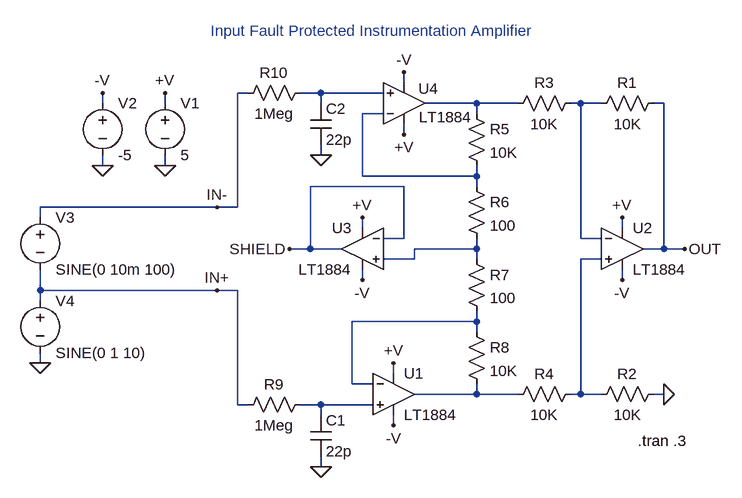
[diagram p0: schematic 1884.asc]
1884.asc, the LTspice schematic file:
Version 4
SHEET 1 896 680
WIRE 240 -240 240 -256
WIRE 0 -224 -16 -224
WIRE 112 -224 80 -224
WIRE 208 -224 112 -224
WIRE -224 -208 -224 -224
WIRE -128 -208 -128 -224
WIRE 112 -208 112 -224
WIRE 352 -208 272 -208
WIRE 416 -208 352 -208
WIRE 512 -208 496 -208
WIRE 544 -208 512 -208
WIRE 640 -208 624 -208
WIRE 208 -192 176 -192
WIRE 352 -192 352 -208
WIRE 240 -160 240 -176
WIRE 112 -128 112 -144
WIRE -224 -112 -224 -128
WIRE -128 -112 -128 -128
WIRE 176 -96 176 -192
WIRE 352 -96 352 -112
WIRE 352 -96 176 -96
WIRE 240 -80 96 -80
WIRE 352 -80 352 -96
WIRE -48 -48 -320 -48
WIRE -16 -48 -16 -224
WIRE -16 -48 -48 -48
WIRE -320 -32 -320 -48
WIRE 176 -16 176 -32
WIRE 576 -16 576 -32
WIRE 240 0 240 -80
WIRE 240 0 208 0
WIRE 512 0 512 -208
WIRE 544 0 512 0
WIRE 96 16 96 -80
WIRE 96 16 64 16
WIRE 144 16 96 16
WIRE 352 16 352 0
WIRE 352 16 256 16
WIRE 640 16 640 -208
WIRE 640 16 608 16
WIRE 672 16 640 16
WIRE 256 32 256 16
WIRE 256 32 208 32
WIRE 352 32 352 16
WIRE 544 32 512 32
WIRE 176 64 176 48
WIRE 576 64 576 48
WIRE -320 80 -320 48
WIRE -48 80 -320 80
WIRE -16 80 -48 80
WIRE -320 96 -320 80
WIRE 352 128 352 112
WIRE 352 128 160 128
WIRE 352 144 352 128
WIRE -320 192 -320 176
WIRE 224 208 224 192
WIRE 160 224 160 128
WIRE 192 224 160 224
WIRE 352 240 352 224
WIRE 352 240 256 240
WIRE 416 240 352 240
WIRE 512 240 512 32
WIRE 512 240 496 240
WIRE 544 240 512 240
WIRE 640 240 624 240
WIRE -16 256 -16 80
WIRE 0 256 -16 256
WIRE 112 256 80 256
WIRE 192 256 112 256
WIRE 112 272 112 256
WIRE 224 288 224 272
WIRE 112 352 112 336
FLAG -128 -112 0
FLAG 224 192 +V
FLAG -128 -224 +V
FLAG 224 288 -V
FLAG -224 -112 0
FLAG -224 -224 -V
FLAG 576 -32 +V
FLAG 576 64 -V
FLAG 176 -32 +V
FLAG 176 64 -V
FLAG 240 -160 +V
FLAG 240 -256 -V
FLAG 640 240 0
FLAG 112 352 0
FLAG 112 -128 0
FLAG -320 192 0
FLAG 672 16 OUT
FLAG -48 -48 IN-
FLAG -48 80 IN+
FLAG 64 16 SHIELD
SYMBOL voltage -128 -224 R0
SYMATTR InstName V1
SYMATTR Value 5
SYMBOL voltage -224 -224 R0
SYMATTR InstName V2
SYMATTR Value -5
SYMBOL opamps\\LT1884 224 176 R0
SYMATTR InstName U1
SYMBOL opamps\\LT1884 576 -48 R0
SYMATTR InstName U2
SYMBOL opamps\\LT1884 176 -48 M0
SYMATTR InstName U3
SYMBOL opamps\\LT1884 240 -144 M180
WINDOW 0 22 87 Left 2
WINDOW 3 23 43 Left 2
SYMATTR InstName U4
SYMBOL res 640 -224 R90
WINDOW 0 0 56 VBottom 2
WINDOW 3 32 56 VTop 2
SYMATTR InstName R1
SYMATTR Value 10K
SYMBOL res 640 224 R90
WINDOW 0 0 56 VBottom 2
WINDOW 3 32 56 VTop 2
SYMATTR InstName R2
SYMATTR Value 10K
SYMBOL res 512 -224 R90
WINDOW 0 0 56 VBottom 2
WINDOW 3 32 56 VTop 2
SYMATTR InstName R3
SYMATTR Value 10K
SYMBOL res 512 224 R90
WINDOW 0 0 56 VBottom 2
WINDOW 3 32 56 VTop 2
SYMATTR InstName R4
SYMATTR Value 10K
SYMBOL res 336 -208 R0
SYMATTR InstName R5
SYMATTR Value 10K
SYMBOL res 336 -96 R0
SYMATTR InstName R6
SYMATTR Value 100
SYMBOL res 336 16 R0
SYMATTR InstName R7
SYMATTR Value 100
SYMBOL res 336 128 R0
SYMATTR InstName R8
SYMATTR Value 10K
SYMBOL cap 96 272 R0
SYMATTR InstName C1
SYMATTR Value 22p
SYMBOL res 96 240 R90
WINDOW 0 0 56 VBottom 2
WINDOW 3 32 56 VTop 2
SYMATTR InstName R9
SYMATTR Value 1Meg
SYMBOL cap 96 -208 R0
SYMATTR InstName C2
SYMATTR Value 22p
SYMBOL res 96 -240 R90
WINDOW 0 0 56 VBottom 2
WINDOW 3 32 56 VTop 2
SYMATTR InstName R10
SYMATTR Value 1Meg
SYMBOL voltage -320 -48 R0
SYMATTR InstName V3
SYMATTR Value SINE(0 10m 100)
SYMBOL voltage -320 80 R0
SYMATTR InstName V4
SYMATTR Value SINE(0 1 10)
TEXT 192 -304 Bottom 2 ;Input Fault Protected Instrumentation Amplifier
TEXT 600 312 Left 2 !.tran .3

The netlist it stands for:
* 1884.asc
V1 +V 0 5
V2 -V 0 -5
XU1 N009 N007 +V -V N008 LT1884  ; pins In+ In- V+ V- OUT
XU2 N006 N003 +V -V OUT LT1884  ; pins In+ In- V+ V- OUT
XU3 N005 SHIELD +V -V SHIELD LT1884  ; pins In+ In- V+ V- OUT
XU4 N001 N004 +V -V N002 LT1884  ; pins In+ In- V+ V- OUT
R1 OUT N003 10K
R2 0 N006 10K
R3 N003 N002 10K
R4 N006 N008 10K
R5 N002 N004 10K
R6 N004 N005 100
R7 N005 N007 100
R8 N007 N008 10K
C1 N009 0 22p
R9 N009 IN+ 1Meg
C2 N001 0 22p
R10 N001 IN- 1Meg
V3 IN- IN+ SINE(0 10m 100)
V4 IN+ 0 SINE(0 1 10)
* Input Fault Protected Instrumentation Amplifier
.tran .3
.backanno
.end